# EAGLE design SimpleControllboard (EAGLE 9.1.1)
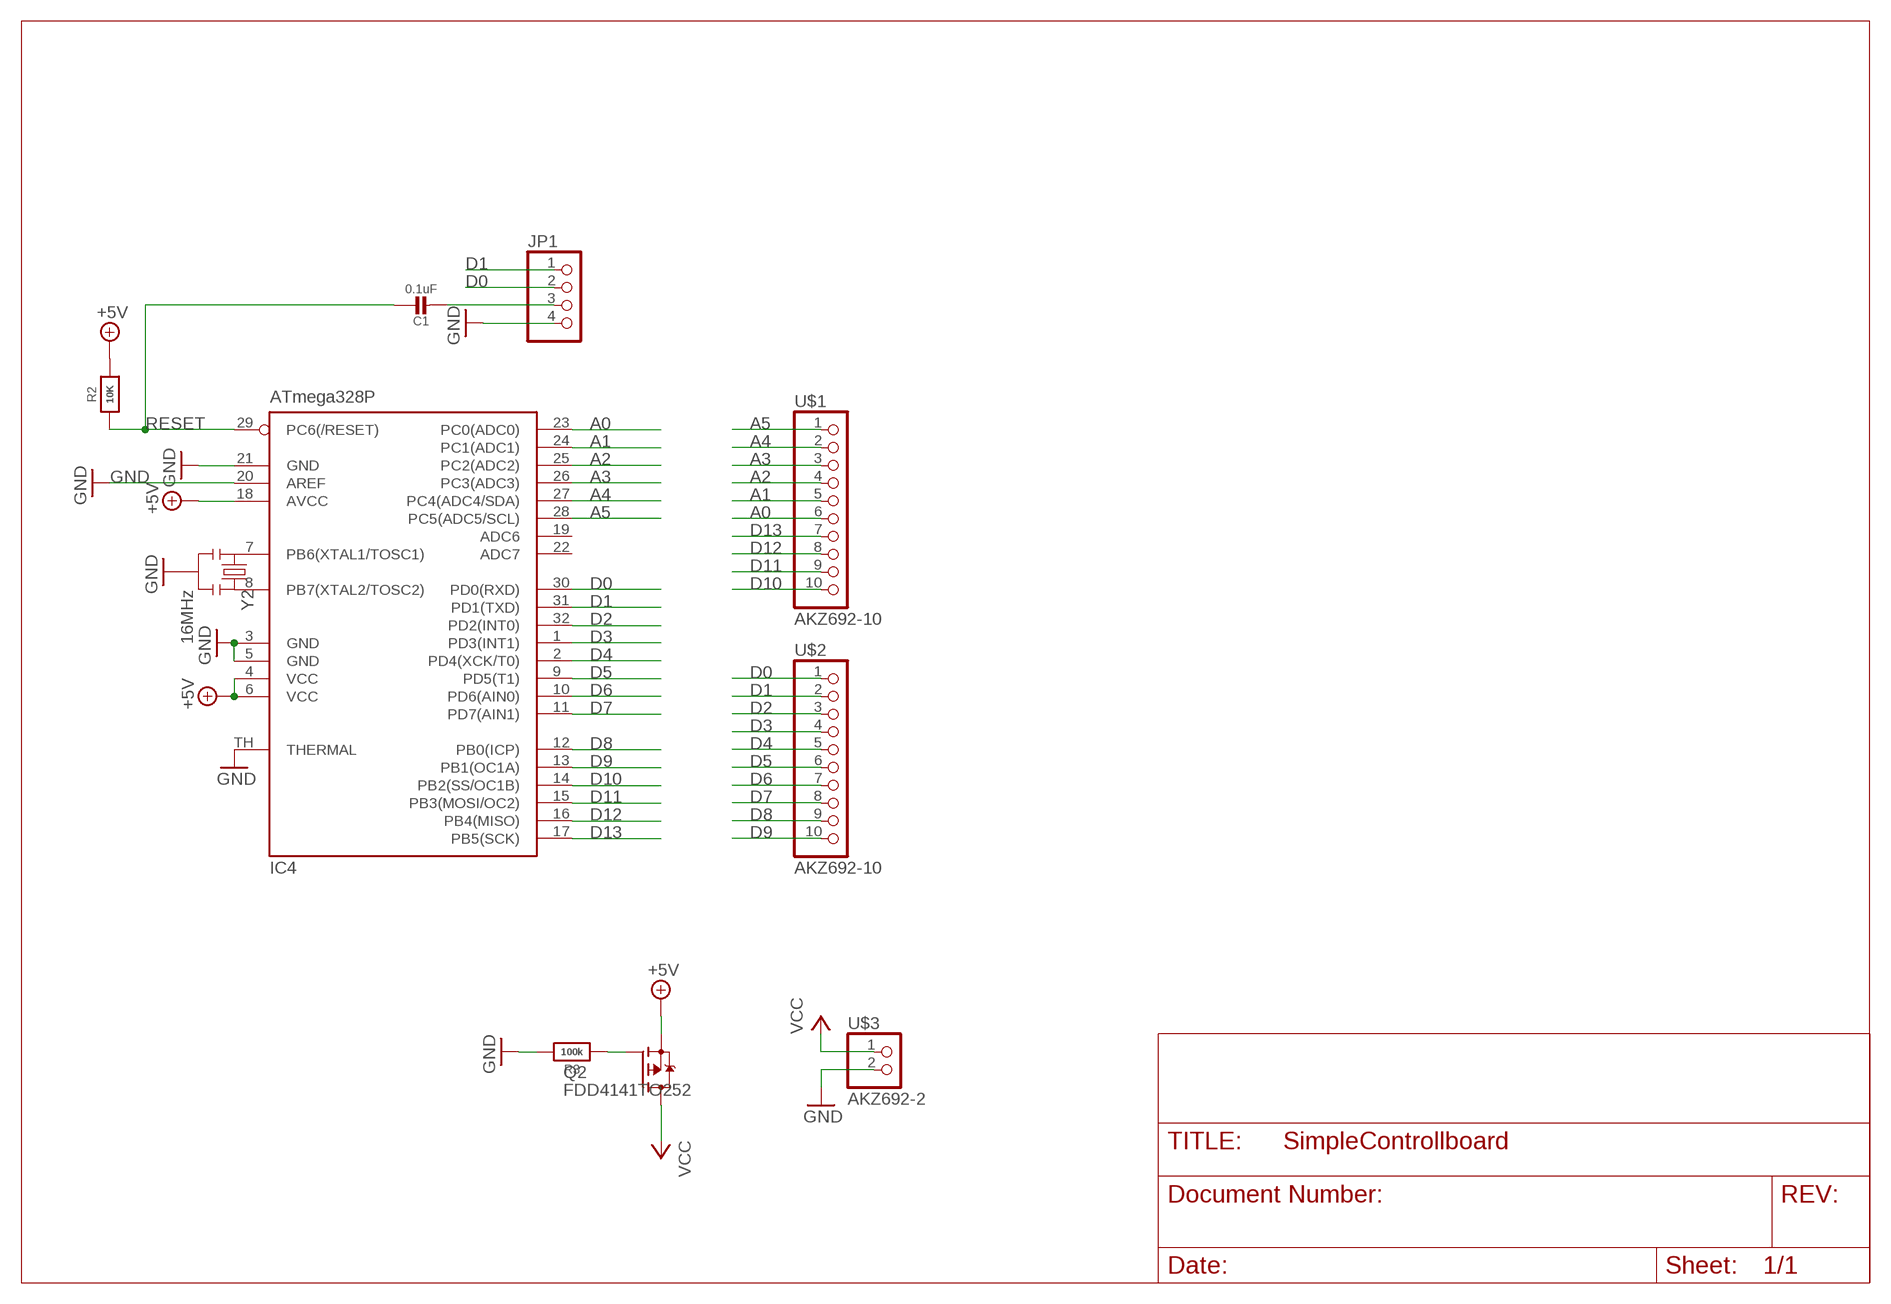
[diagram p0: schematic, sheet 1]

## Parts
C1  0.1uF  CAP_CERAMIC0805-NOOUTLINE  [0805-NO]
IC4  ATmega328P  MEGA8-MI  [MLF32-TH]
JP1  PINHD-1X4  [1X04]
Q2  FDD4141TO252  [TO252]
R2  10K  RESISTOR0805_NOOUTLINE  [0805-NO]
R3  100k  RESISTOR0805_NOOUTLINE  [0805-NO]
U$1  AKZ692-10  [1X10]
U$2  AKZ692-10  [1X10]
U$3  AKZ692-2  [1X2]
Y2  16MHz  RESONATORSMD  [RESONATOR-SMD]

## Nets
+5V: IC4.4(VCC) IC4.6(VCC) IC4.18(AVCC) Q2.2(S) R2.2
A0: IC4.23(PC0(ADC0)) U$1.6
A1: IC4.24(PC1(ADC1)) U$1.5
A2: IC4.25(PC2(ADC2)) U$1.4
A3: IC4.26(PC3(ADC3)) U$1.3
A4: IC4.27(PC4(ADC4/SDA)) U$1.2
A5: IC4.28(PC5(ADC5/SCL)) U$1.1
D0: IC4.30(PD0(RXD)) JP1.2 U$2.1
D1: IC4.31(PD1(TXD)) JP1.1 U$2.2
D2: IC4.32(PD2(INT0)) U$2.3
D3: IC4.1(PD3(INT1)) U$2.4
D4: IC4.2(PD4(XCK/T0)) U$2.5
D5: IC4.9(PD5(T1)) U$2.6
D6: IC4.10(PD6(AIN0)) U$2.7
D7: IC4.11(PD7(AIN1)) U$2.8
D8: IC4.12(PB0(ICP)) U$2.9
D9: IC4.13(PB1(OC1A)) U$2.10
D10: IC4.14(PB2(SS/OC1B)) U$1.10
D11: IC4.15(PB3(MOSI/OC2)) U$1.9
D12: IC4.16(PB4(MISO)) U$1.8
D13: IC4.17(PB5(SCK)) U$1.7
DTR/RTS1: C1.2 JP1.3
GND [power]: IC4.3(GND) IC4.5(GND) IC4.20(AREF) IC4.21(GND) IC4.TH(THERMAL) JP1.4 R3.2 U$3.2 Y2.2
N$7: IC4.8(PB7(XTAL2/TOSC2)) Y2.3
N$8: IC4.7(PB6(XTAL1/TOSC1)) Y2.1
N$62: Q2.1(G) R3.1
RESET: C1.1 IC4.29(PC6(/RESET)) R2.1
VCC: Q2.3(D) U$3.1
Unconnected: IC4.19(ADC6) IC4.22(ADC7)

## Library data of the parts
C1 = microbuilder:CAP_CERAMIC: Ceramic Capacitors For new designs, use the packages preceded by an '_' character since they are more reliable: The following footprints should be used on most boards: _0402 - Standard footprint for regular board layouts _0603 - Standard footprint for regular board layouts _0805 - Standard footprint for regular board layouts _1206 - Standard footprint for regular board layouts For extremely tight-pitch boards where space is at a premium, the following 'micro-pitch' footprints can be used (smaller pads, no silkscreen outline, etc.): _0402MP - Micro-pitch footprint for very dense/compact boards _0603MP - Micro-pitch footprint for very dense/compact boards _0805MP - Micro-pitch footprint for very dense/compact boards _1206MP - Micro-pitch footprint for very dense/compact boards
IC4 = microbuilder:MEGA8-MI: MICROCONTROLLER 8 Kbytes FLASH, 1 kbytes SRAM, 512 bytes EEPROM, USART, 6-channel 10 bit ADC, 2-channel 8 bit ADC Pin compatible with Atmega48, ATMega88, ATMega168 Source: avr.lbr; MPN: ATMEGA88PA-MU; OC_FARNELL: 1715491; OC_NEWARK: 15R0272
JP1 = pinhead:PINHD-1X4: PIN HEADER
Q2 = transistor-fet:FDD4141: P-Channel PowerTrench® MOSFET Source: FDD4141.pdf
R2 R3 = microbuilder:RESISTOR: Resistors For new designs, use the packages preceded by an '_' character since they are more reliable: The following footprints should be used on most boards: _0402 - Standard footprint for regular board layouts _0603 - Standard footprint for regular board layouts _0805 - Standard footprint for regular board layouts _1206 - Standard footprint for regular board layouts For extremely tight-pitch boards where space is at a premium, the following 'micro-pitch' footprints can be used (smaller pads, no silkscreen outline, etc.): _0402MP - Micro-pitch footprint for very dense/compact boards _0603MP - Micro-pitch footprint for very dense/compact boards _0805MP - Micro-pitch footprint for very dense/compact boards _1206MP - Micro-pitch footprint for very dense/compact boards
U$1 U$2 = HeRo:AKZ692-10
U$3 = HeRo:AKZ692-2
Y2 = SparkFun:RESONATOR: Resonator Small SMD resonator. This is the itty bitty 10/20MHz resonators with built in caps. CSTCE10M0G55 and CSTCE20M0V53. Footprint has been reviewed closely but hasn't been tested yet.

## Net classes
1 power: width 0.305 mm

## Board
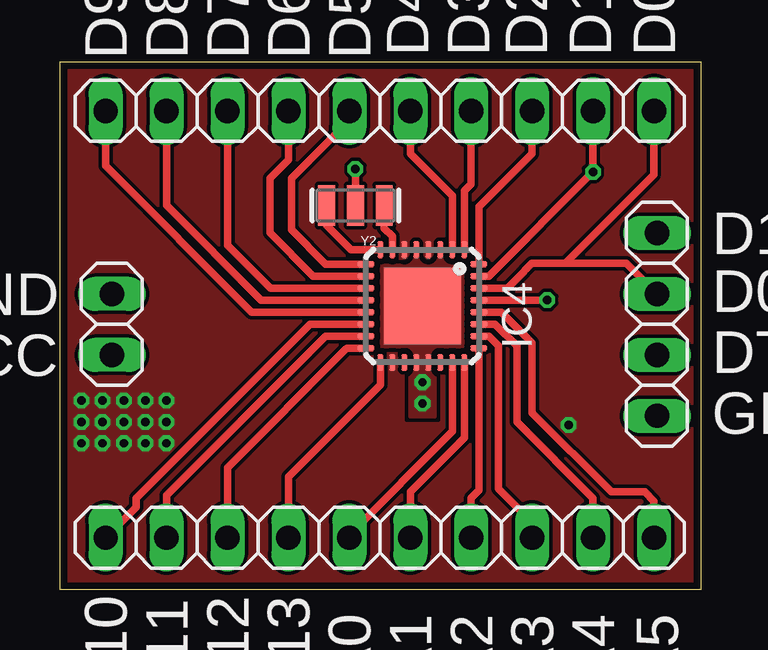
[diagram p1: board, top side]
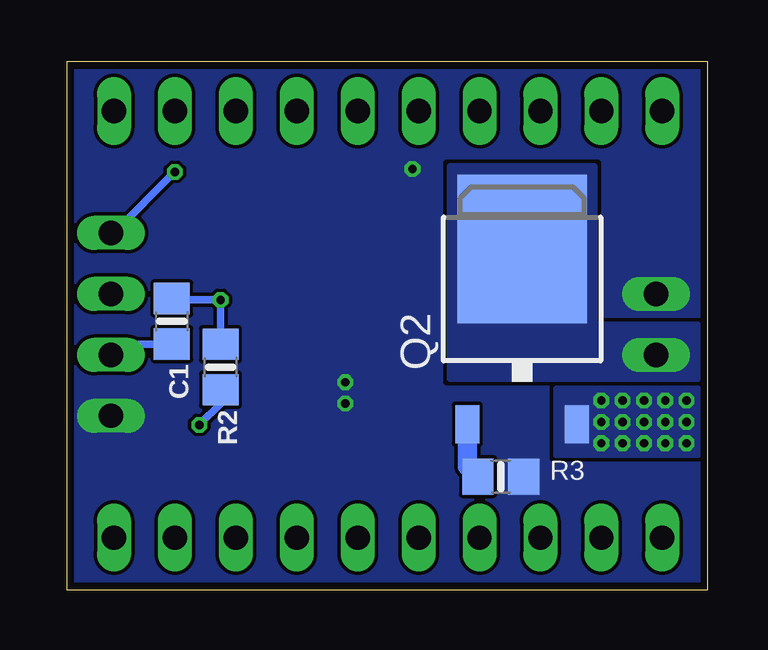
[diagram p2: board, bottom side, seen from below]

Size 26.73 x 22 mm. Coordinates in mm from the lower left corner, seen from the top.
Outline: 0,0 0,22 26.73,22 26.73,0 0,0
Copper layers (1*16): Top 0.035mm / dielectric 1.5mm / Bottom 0.035mm
Design rules "PCB-POOL Standard *": minimum track width 0.15mm, minimum drill 0.3mm, track to track 0.15mm, track to pad 0.15mm, pad to pad 0.15mm, via to via 0.15mm, smd to smd 0.15mm, copper to edge 0.3mm, drill to drill 0.2mm, minimum pad ring 0.2mm, minimum via ring 0.15mm, stop-mask expansion 0.075mm, vias tented up to drill 0mil, thermal gap 0.2mm

### Footprints (pad centres in the part's own frame; a part is rotated, then mirrored left to right if it is on the bottom)
0805-NO = smd 1.3 x 1.5: 1 -0.95,0; 2 0.95,0
MLF32-TH = smd 0.7 x 0.25: 1 -2.35,1.75; 2 -2.35,1.25; 3 -2.35,0.75; 4 -2.35,0.25; 5 -2.35,-0.25; 6 -2.35,-0.75; 7 -2.35,-1.25; 8 -2.35,-1.75; 17 2.35,-1.75; 18 2.35,-1.25; 19 2.35,-0.75; 20 2.35,-0.25; 21 2.35,0.25; 22 2.35,0.75; 23 2.35,1.25; 24 2.35,1.75 | smd 0.25 x 0.7: 9 -1.75,-2.35; 10 -1.25,-2.35; 11 -0.75,-2.35; 12 -0.25,-2.35; 13 0.25,-2.35; 14 0.75,-2.35; 15 1.25,-2.35; 16 1.75,-2.35; 25 1.75,2.35; 26 1.25,2.35; 27 0.75,2.35; 28 0.25,2.35; 29 -0.25,2.35; 30 -0.75,2.35; 31 -1.25,2.35; 32 -1.75,2.35 | smd 3.2 x 3.2: TH 0,0
1X04 = drill 1.016 long: 1 -3.81,0; 2 -1.27,0; 3 1.27,0; 4 3.81,0
TO252 = smd 1 x 1.6: 1 -2.28,-4.8; 2 2.28,-4.8 | smd 5.4 x 6.2: 3 0,2.5
1X10 = drill 1.016 long: 1 -11.43,0; 2 -8.89,0; 3 -6.35,0; 4 -3.81,0; 5 -1.27,0; 6 1.27,0; 7 3.81,0; 8 6.35,0; 9 8.89,0; 10 11.43,0
1X2 = drill 1.016 long: 1 -1.27,0; 2 1.27,0
RESONATOR-SMD = smd 0.7 x 1.7: 1 -1.2,0; 2 0,0; 3 1.2,0

### Placement (x,y rotation side)
C1  22.35,11.18 270 bottom
IC4  15.11,11.81 270 top
JP1  24.89,11.05 270 top
Q2  7.75,11.68 0 bottom
R2  20.32,9.27 270 bottom
R3  8.64,4.7 0 bottom
U$1  13.34,2.16 180 top
U$2  13.34,19.94 180 top
U$3  2.16,11.05 90 top
Y2  12.32,16 180 top

### Tracks (layer width: path | path; a pad name or v marks a point on that pad's centre or on a via)
+5V  (via drill 0.35)
  Bottom 0.305: R2.2 20.32,7.75 v21.21,6.86
  other vias: 0.89,6.1 0.89,6.99 0.89,7.87 1.78,7.87 2.67,7.87 3.56,7.87 1.78,6.99 2.67,6.99 3.56,6.99 1.78,6.1 2.67,6.1 3.56,6.1 4.45,7.87 4.45,6.99 4.45,6.1
  pour Top (rank 2, no thermals): 0,22 0,0 26.73,0 26.73,22
  pour Bottom (no thermals): 6.35,8.38 6.35,5.59 0.38,5.59 0.38,8.38
A0
  Top 0.305: IC4.23 16.36,6.58 12.06,2.29 U$1.6
A1
  Top 0.305: IC4.24 16.86,6.32 14.61,4.06 U$1.5
A2
  Top 0.305: IC4.25 17.46,4.13 17.14,3.81 U$1.4
A3
  Top 0.305: IC4.26 17.89,10.56 18.29,10.16 18.29,4.19 19.68,2.79 U$1.3
A4
  Top 0.305: IC4.27 18.14,11.06 19.05,10.15 19.05,6.99 22.23,3.81 U$1.2
A5
  Top 0.305: IC4.28 18.41,11.56 19.68,10.29 19.68,7.37 22.99,4.06 24.38,4.06 24.77,3.68 U$1.1
D0
  Top 0.305: IC4.30 18.41,12.56 18.66,12.56 19.05,12.95 19.68,13.59 21.08,13.59 | U$2.1 24.77,17.27 21.08,13.59 | 21.08,13.59 23.62,13.59 JP1.2
D1  (via drill 0.35)
  Top 0.305: IC4.31 17.89,13.06 v22.23,17.4 U$2.2
  Bottom 0.305: v22.23,17.4 24.77,14.86 JP1.1
D2
  Top 0.305: IC4.32 17.46,15.94 19.68,18.16 U$2.3
D3
  Top 0.305: IC4.1 16.86,16.61 17.14,16.89 U$2.4
D4
  Top 0.305: IC4.2 16.36,16.4 14.61,18.16 U$2.5
D5
  Top 0.305: IC4.9 11.08,13.56 9.65,14.99 9.65,17.14 12.06,19.56 U$2.6
D6
  Top 0.305: IC4.10 10.56,13.06 8.76,14.86 8.76,17.14 9.53,17.91 U$2.7
D7
  Top 0.305: IC4.11 8.78,12.56 6.99,14.35 U$2.8
D8
  Top 0.305: IC4.12 8.39,12.06 4.45,16 U$2.9
D9
  Top 0.305: IC4.13 8,11.56 1.91,17.65 U$2.10
D10
  Top 0.305: IC4.14 10.43,11.06 3.17,3.81 3.17,3.43 U$1.10
D11
  Top 0.305: IC4.15 11.07,10.56 4.45,3.94 U$1.9
D12
  Top 0.305: U$1.8 6.99,5.08 11.89,9.99 11.97,10.06 IC4.16
D13
  Top 0.305: IC4.17 13.36,8.54 9.53,4.7 U$1.7
DTR/RTS1
  Bottom 0.305: C1.2 24.45,10.23 JP1.3
GND  (via drill 0.35)
  Top 0.305: Y2.2 12.32,17.14 v12.32,17.53
  other vias: 15.11,8.64 15.11,7.75
  pour Bottom (rank 2, no thermals): 0,22 0,0 26.73,0 26.73,22
  pour Top (isolate 0.254, no thermals): 13.34,13.46 13.34,10.16 14.61,10.16 14.61,7.24 15.62,7.24 15.62,10.16 16.89,10.16 16.89,13.59 16,13.59 16,14.22 15.75,14.22 15.75,13.59 14.99,13.59 14.99,14.22 14.73,14.22 14.73,13.59 13.34,13.59
N$7
  Top 0.305: Y2.3 11.12,15.17 12.13,14.16 IC4.8
N$8
  Top 0.305: IC4.7 13.86,14.71 13.52,15.06 Y2.1
N$62
  Bottom 0.813: R3.1 10.03,5.14 Q2.1
RESET  (via drill 0.35)
  Top 0.305: IC4.29 v20.32,12.06
  Bottom 0.305: R2.1 v20.32,12.06 22.29,12.06 C1.1
VCC
  pour Bottom (no thermals): 0.38,11.05 4.7,11.05 4.7,17.65 9.65,17.65 10.79,17.65 10.79,8.76 0.38,8.76

### Text on the board
tPlace: D9 | D8 | D7 | D6 | D5 | D4 | D3 | D2 | D1 | D0 | D1 | D0 | GND | VCC | DTR/RTS/RESET | GND | D10 | D11 | D12 | D13 | A0 | A1 | A2 | A3 | A4 | A5